# EasyEDA Pro project 15A.epro

# Schematic SCH
Create Date: 2023-10-26; Page Name: S1; Project Name: 15_模拟; Schematic Name: SCH; Update Date: 2023-10-27
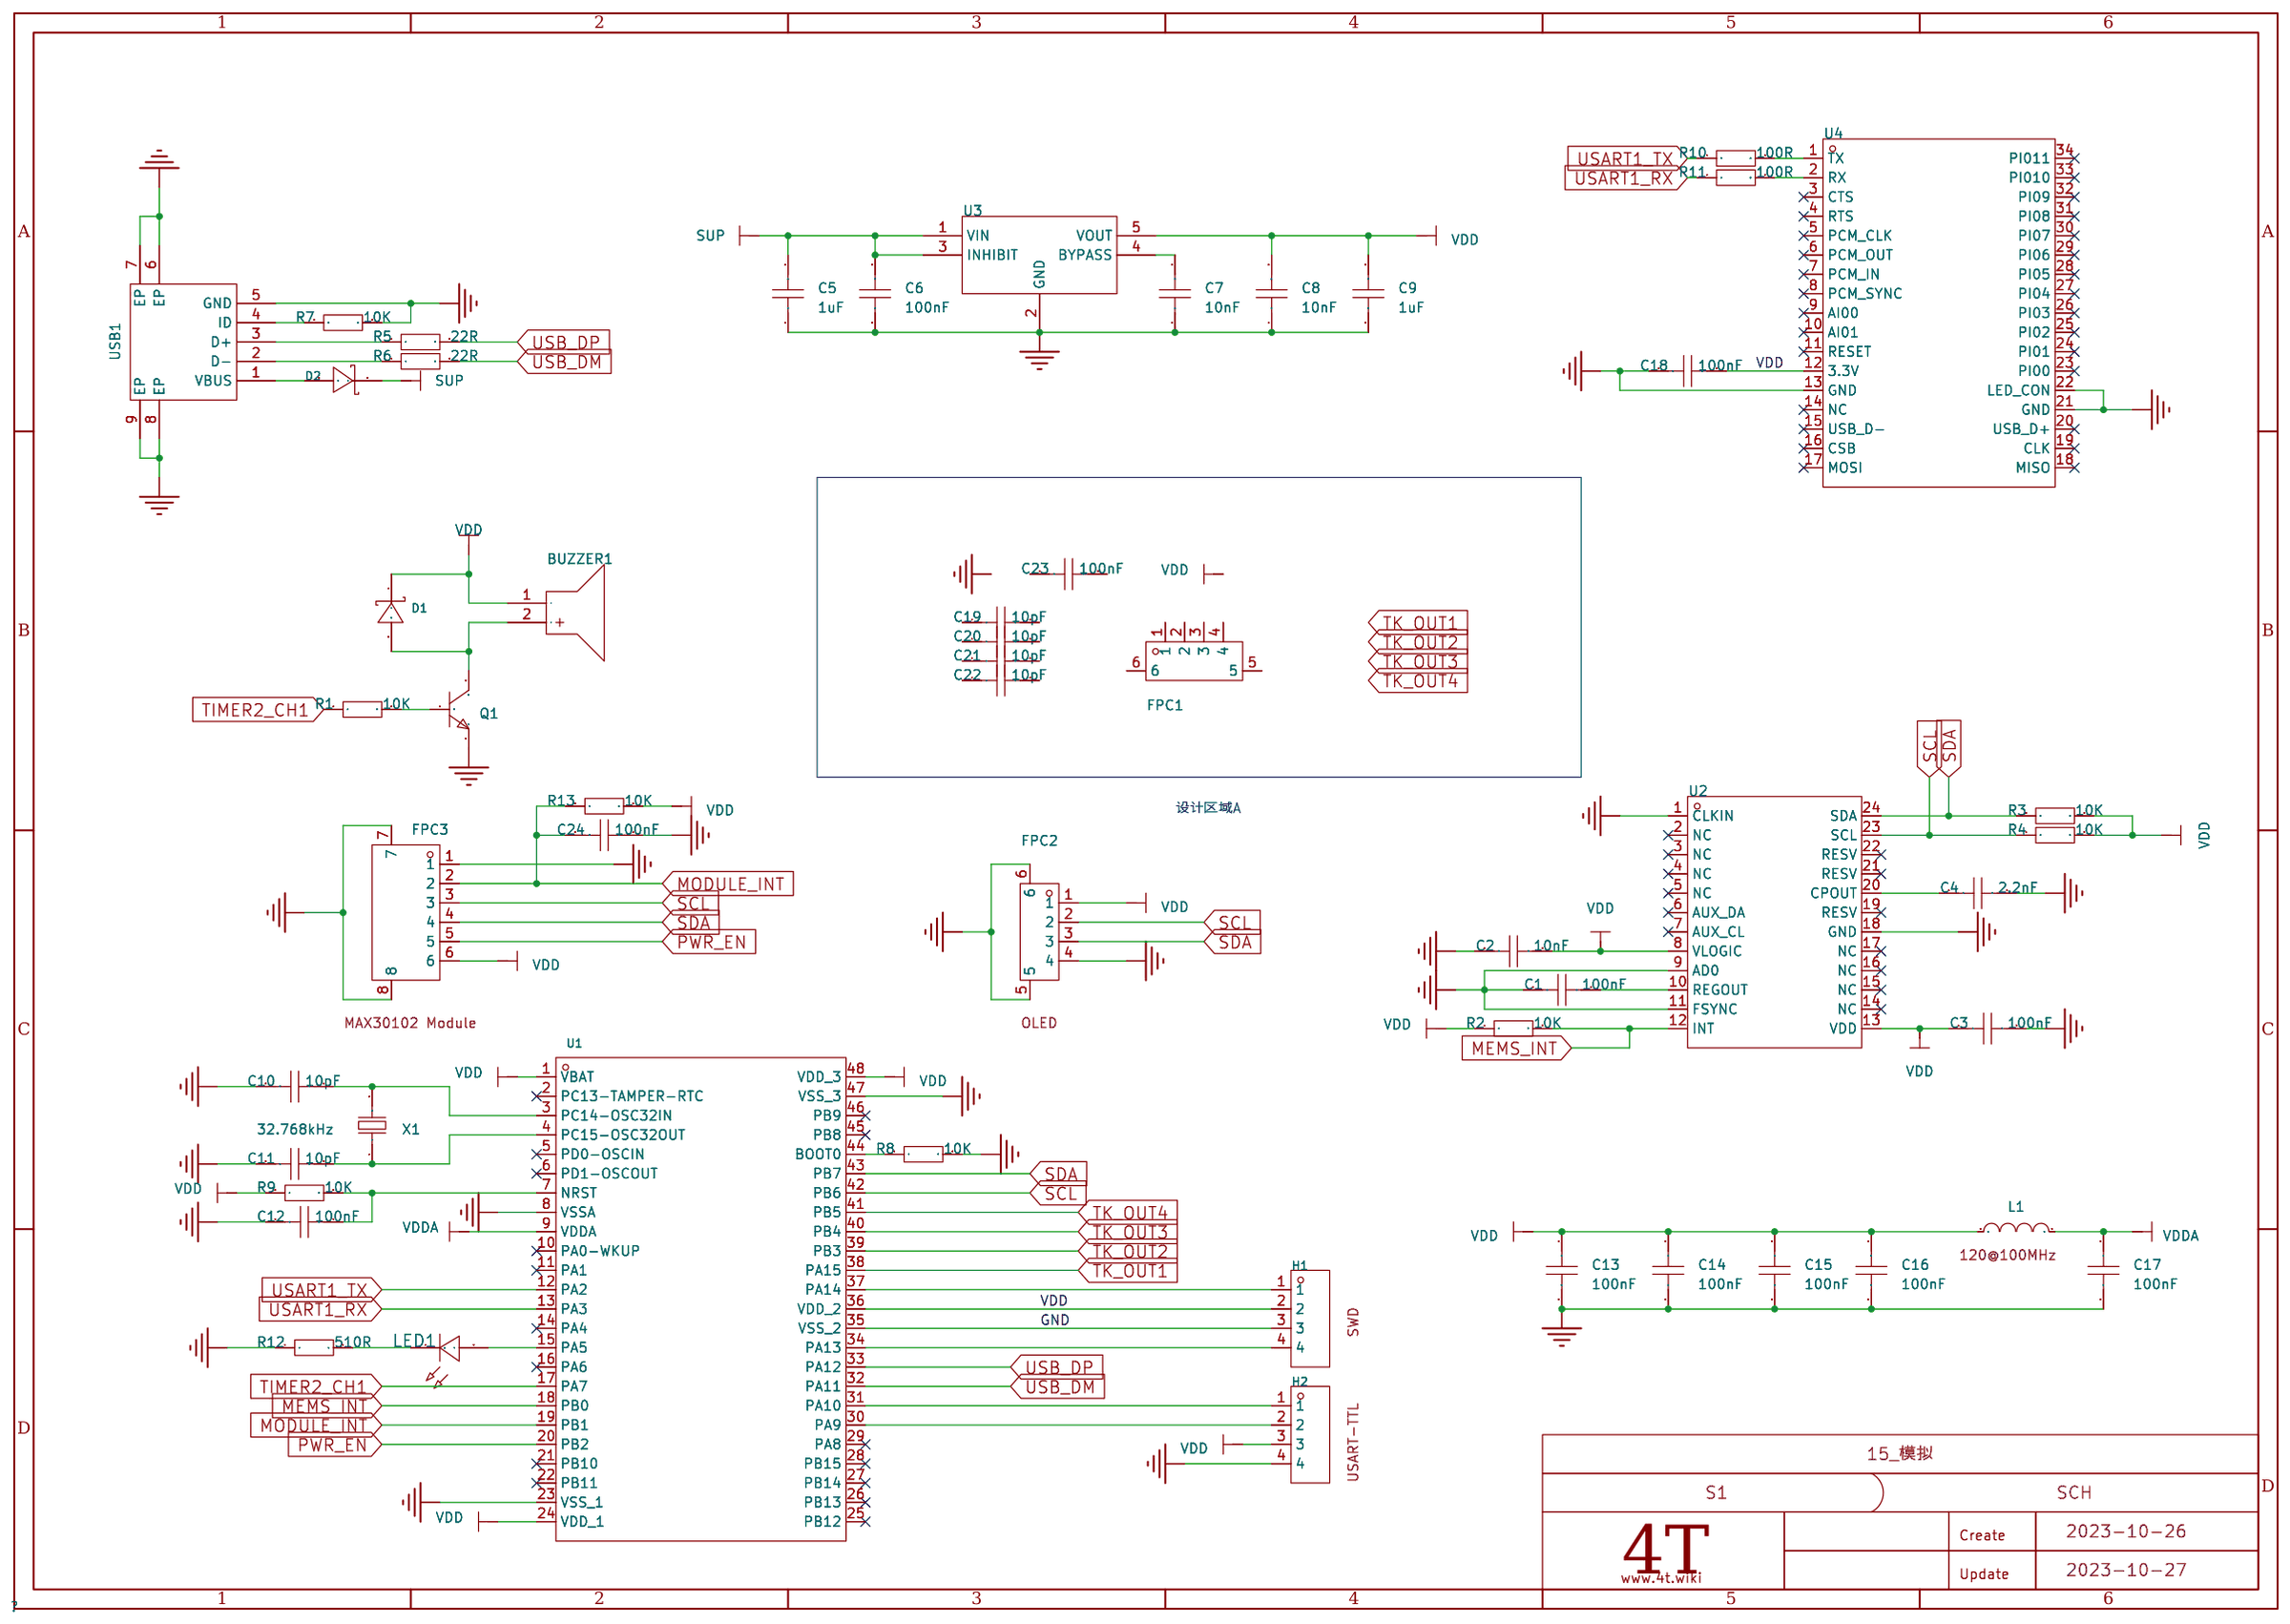
[diagram p0: schematic sheet]

## Parts
BUZZER1  buzzer  [BUZ-TH_BD12.0-P6.00-D0.9-RD]
C1  100nF  [C0805]
C2  10nF  [C0805]
C3  100nF  [C0805]
C4  2.2nF  [C0805]
C5  1uF  [C0805]
C6  100nF  [C0805]
C7  10nF  [C0805]
C8  10nF  [C0805]
C9  1uF  [C0805]
C10  10pF  [C0805]
C11  10pF  [C0805]
C12  100nF  [C0805]
C13  100nF  [C0805]
C14  100nF  [C0805]
C15  100nF  [C0805]
C16  100nF  [C0805]
C17  100nF  [C0805]
C18  100nF  [C0805]
C19  10pF  [C0805]
C20  10pF  [C0805]
C21  10pF  [C0805]
C22  10pF  [C0805]
C23  100nF  [C0805]
C24  100nF  [C0805]
D1  SS14  [SMA_L4.2-W2.6-LS5.3-RD]
D2  SS14  [SMA_L4.2-W2.6-LS5.3-RD]
FPC1  FPC-4PIN-1.0MM-上接  [FPC-SMD_4P-P1.00_AFA07-S04ECC-00]
FPC2  FPC-4PIN-1.0MM-上接  [FPC-SMD_4P-P1.00_AFA07-S04ECC-00]
FPC3  FPC6-0.5mm  [FPC-SMD_6P-L9.3-W4.1-P0.50]
H1  -  [HDR-TH_4P-P2.54-V-F]
H2  -  [HDR-TH_4P-P2.54-V-F]
L1  ACMS201209A6012A  [L0805]
LED1  -  [LED_0805]
Q1  S8050  [SOT-23-3_L2.9-W1.3-P1.90-LS2.4-BR]
R1  10K  [R0805]
R2  10K  [R0805]
R3  10K  [R0805]
R4  10K  [R0805]
R5  22R  [R0805]
R6  22R  [R0805]
R7  10K  [R0805]
R8  10K  [R0805]
R9  10K  [R0805]
R10  100R  [R0805]
R11  100R  [R0805]
R12  510R  [R0805]
R13  10K  [R0805]
U1  GD32F303CBT6  [LQFP-48_L7.0-W7.0-P0.50-LS9.0-BL]
U2  MPU6050  [QFN-24_L4.0-W4.0-P0.50-BL]
U3  LD3985M33R  [SOT-23-5_L3.0-W1.7-P0.95-LS2.8-BR]
U4  HC-05  [BULETM-SMD_HC-05]
USB1  MicroUSB-5PIN  [USB-SMD_5P_MICROUSB-5PIN]
X1  32.768kHz  [FC-135R_L3.2-W1.5]

## Library data of the parts
BUZZER1 = buzzer: Supplier Part: C9900014030; JLCPCB Part Class: 扩展库; Supplier: LCSC
C1-C24 = CAP_0805: Supplier Footprint: 0805
D1 D2 = SS14_C2480: 二极管配置:独立式;直流反向耐压(Vr):40V;平均整流电流(Io):1A;正向压降(Vf):550mV@1A;; LCSC Part Name: 电压:40V 电流:1A 框架工艺; Supplier Part: C2480; Manufacturer: MDD; Supplier Footprint: SMA(DO-214AC); JLCPCB Part Class: 基础库; Datasheet: https://atta.szlcsc.com/upload/public/pdf/source/20230712/2DB6064CFBB99DE6DB116BEE8208BE66.pdf; Supplier: LCSC; Diode Configuration: 独立式; Reverse Voltage (Vr): 40V; Average Rectified Current (Io): 1A; Forward Voltage (Vf@If): 550mV@1A; Reverse Leakage Current (Ir): 500uA@40V
FPC1 = FPC-4PIN-1.0MM-上接: Supplier Part: C9900018775; Supplier Footprint: 4Pin_FPC_1mm; JLCPCB Part Class: 扩展库; Datasheet: https://atta.szlcsc.comnull; Supplier: LCSC
FPC2 = FPC-4PIN-1.0MM-上接: OLED; Supplier Part: C9900018775; Supplier Footprint: 4Pin_FPC_1mm; JLCPCB Part Class: 扩展库; Datasheet: https://atta.szlcsc.comnull; Supplier: LCSC
FPC3 = FPC6-0.5mm: MAX30102 Module; Supplier Part: C9900007660; Supplier Footprint: FPC-6P,0.5mm,上接; JLCPCB Part Class: 扩展库; Datasheet: https://atta.szlcsc.comnull; Supplier: LCSC
H1 = HDR-F_2.54_1x4P: SWD; Supplier Part: C2718488; Supplier Footprint: 插件
H2 = HDR-F_2.54_1x4P: USART-TTL; Supplier Part: C2718488; Supplier Footprint: 插件
L1 = ACMS201209A6012A: 120@100MHz; LCSC Part Name: 单路 0805磁珠 阻抗600Ω@100MHz; Supplier Part: C963878; Manufacturer: HYHONGYEX(宏业); Supplier Footprint: 0805; JLCPCB Part Class: 扩展库; Datasheet: https://atta.szlcsc.com/upload/public/pdf/source/20201201/C963878_9A58496702C302FABFA03D4B99520494.pdf; Supplier: LCSC; Impedance @ Frequency: 600Ω@100MHz; Tolerance: ±25%; DC Resistance: 100mΩ; Current Rating: 2A; Circuits: 1
LED1 = LED_0805-R: Supplier Footprint: 0805
Q1 = S8050: NPN 25V 500mA 120-400 SOT-23; LCSC Part Name: NPN 25V 500mA 120-400 SOT-23; Supplier Part: C2931719; Manufacturer: Doeshare(德芯); Supplier Footprint: SOT-23; JLCPCB Part Class: 扩展库; Datasheet: https://atta.szlcsc.com/upload/public/pdf/source/20220117/E6D3315E0D6ADDB25840BFFAC039C5C0.pdf; Supplier: LCSC
R1-R13 = Res_0805: Supplier Footprint: 0805
U1 = GD32F303CBT6: LCSC Part Name: 被合并商品; Supplier Part: C3013781; Supplier Footprint: LQFP-48(7x7); JLCPCB Part Class: 扩展库; Supplier: LCSC
U2 = MPU6050: Supplier Part: C9900042518; Supplier Footprint: QFN-24_L4.0-W4.0-P0.50-BL-EP2.7; Supplier: LCSC
U3 = LD3985M33R: 输出类型:固定;输出极性:正;最大输入电压:6V;输出电压:3.3V;输出电流:150mA;电源纹波抑制比(PSRR):60dB;; LCSC Part Name: 输入6V 输出3.3V 150mA; Supplier Part: C46243; Manufacturer: ST(意法半导体); Supplier Footprint: SOT-23-5; JLCPCB Part Class: 扩展库; Datasheet: https://atta.szlcsc.com/upload/public/pdf/source/20150407/1457707276603.pdf; Supplier: LCSC; Output Type: 固定; Output Polarity: 正; Number of Outputs: 1; Maximum Input Voltage: 6V; Output Voltage: 3.3V; Dropout Voltage: 100mV@(150mA); Quiescent Current (Ground Current): 150uA; Output Current: 150mA; Power Supply Rejection Ratio (PSRR): 60dB; Operating Temperature: -40℃~+125℃
U4 = HC-05: Supplier Part: C9900001063; Supplier Footprint: SMD-34_13.0X27.0X1.50P; JLCPCB Part Class: 扩展库; Datasheet: 2021-10-26/262798S/0744a6e575994a8186035cee355055ea/HC-05.pdf; Supplier: LCSC
USB1 = MicroUSB-5PIN: Supplier Part: C9900001196; Supplier Footprint: MicroUSB-5PIN,; JLCPCB Part Class: 扩展库; Supplier: LCSC
X1 = Q13FC1350000400: 频率:32.768kHz;频率公差:±20ppm;负载电容:12.5pF;; LCSC Part Name: 32.768kHz ±20ppm 12.5pF; Supplier Part: C32346; Manufacturer: EPSON(爱普生); Supplier Footprint: SMD3215-2P; JLCPCB Part Class: 基础库; Datasheet: https://atta.szlcsc.com/upload/public/pdf/source/20190108/C32346_746D6B07EAF90824457A96480007685F.pdf; Supplier: LCSC; Crystal Type: 贴片无源晶振; Frequency Tolerance: ±20ppm; Load Capacitance: 12.5pF; Equivalent Series Resistance (ESR): 70kΩ; Operating Temperature: -40℃~+85℃

## Nets
GND: C1.1 C2.1 C3.2 C4.2 C5.1 C6.1 C7.1 C8.1 C9.1 C10.2 C11.2 C12.2 C13.2 C14.2 C15.2 C16.2 C17.2 C18.1 C24.1 FPC2.4 FPC2.5 FPC2.6 FPC3.1 FPC3.7 FPC3.8 H1.3 H2.4 Q1.2(E) R7.2 R8.2 R12.1 U1.8(VSSA) U1.23(VSS_1) U1.35(VSS_2) U1.47(VSS_3) U2.1(CLKIN) U2.9(AD0) U2.11(FSYNC) U2.18(GND) U3.2(GND) U4.13(GND) U4.21(GND) U4.22(LED_CON) USB1.5(GND) USB1.6(EP) USB1.7(EP) USB1.8(EP) USB1.9(EP)
VDD: BUZZER1.1(-) C2.2 C3.1 C8.2 C9.2 C13.1 C14.1 C15.1 C16.1 C18.2 D1.1(K) FPC2.1 FPC3.6 H1.2 H2.3 L1.1 R2.1 R3.2 R4.2 R9.1 R13.2 U1.1(VBAT) U1.24(VDD_1) U1.36(VDD_2) U1.48(VDD_3) U2.8(VLOGIC) U2.13(VDD) U3.5(VOUT) U4.12(3.3V)
VDDA: C17.1 L1.2 U1.9(VDDA)
MEMS_INT: R2.2 U1.18(PB0) U2.12(INT)
MODULE_INT: C24.2 FPC3.2 R13.1 U1.19(PB1)
PWR_EN: FPC3.5 U1.20(PB2)
SCL: FPC2.2 FPC3.3 R4.1 U1.42(PB6) U2.23(SCL)
SDA: FPC2.3 FPC3.4 R3.1 U1.43(PB7) U2.24(SDA)
SUP: C5.2 C6.2 D2.1(K) U3.1(VIN) U3.3(INHIBIT)
TIMER2_CH1: R1.1 U1.17(PA7)
TK_OUT1: U1.38(PA15)
TK_OUT2: U1.39(PB3)
TK_OUT3: U1.40(PB4)
TK_OUT4: U1.41(PB5)
USART1_RX: R11.1 U1.13(PA3)
USART1_TX: R10.1 U1.12(PA2)
USB_DM: R6.2 U1.32(PA11)
USB_DP: R5.2 U1.33(PA12)
Net-(BUZZER1-2): BUZZER1.2(+) D1.2(A) Q1.3(C)
Net-(C1-2): C1.2 U2.10(REGOUT)
Net-(C4-1): C4.1 U2.20(CPOUT)
Net-(C7-2): C7.2 U3.4(BYPASS)
Net-(C10-1): C10.1 U1.3(PC14-OSC32IN) X1.2
Net-(C11-1): C11.1 U1.4(PC15-OSC32OUT) X1.1
Net-(C12-1): C12.1 R9.2 U1.7(NRST)
Net-(D2-2): D2.2(A) USB1.1(VBUS)
Net-(H1-1): H1.1 U1.37(PA14)
Net-(H1-4): H1.4 U1.34(PA13)
Net-(H2-1): H2.1 U1.31(PA10)
Net-(H2-2): H2.2 U1.30(PA9)
Net-(LED1-1): LED1.1(C) R12.2
Net-(LED1-2): LED1.2(A) U1.15(PA5)
Net-(Q1-1): Q1.1(B) R1.2
Net-(R5-1): R5.1 USB1.3(D+)
Net-(R6-1): R6.1 USB1.2(D-)
Net-(R7-1): R7.1 USB1.4(ID)
Net-(R8-1): R8.1 U1.44(BOOT0)
Net-(R10-2): R10.2 U4.1(TX)
Net-(R11-2): R11.2 U4.2(RX)

Not connected (* = marked no-connect by the designer): C19 1 2; C20 1 2; C21 1 2; C22 1 2; C23 1 2; FPC1 1 2 3 4 5 6; U1 2(PC13-TAMPER-RTC)* 5(PD0-OSCIN)* 6(PD1-OSCOUT)* 10(PA0-WKUP)* 11(PA1)* 14(PA4)* 16(PA6)* 21(PB10)* 22(PB11)* 25(PB12)* 26(PB13)* 27(PB14)* 28(PB15)* 29(PA8)* 45(PB8)* 46(PB9)*; U2 2(NC)* 3(NC)* 4(NC)* 5(NC)* 6(AUX_DA)* 7(AUX_CL)* 14(NC)* 15(NC)* 16(NC)* 17(NC)* 19(RESV)* 21(RESV)* 22(RESV)*; U4 3(CTS)* 4(RTS)* 5(PCM_CLK)* 6(PCM_OUT)* 7(PCM_IN)* 8(PCM_SYNC)* 9(AI00)* 10(AI01)* 11(RESET)* 14(NC)* 15(USB_D-)* 16(CSB)* 17(MOSI)* 18(MISO)* 19(CLK)* 20(USB_D+)* 23(PI00)* 24(PI01)* 25(PI02)* 26(PI03)* 27(PI04)* 28(PI05)* 29(PI06)* 30(PI07)* 31(PI08)* 32(PI09)* 33(PI010)* 34(PI011)*

## Notes on the sheet
- 设计区域A
